# Altium schematic sheet RGB2HDMI.schdoc
size 316 x 216 mm
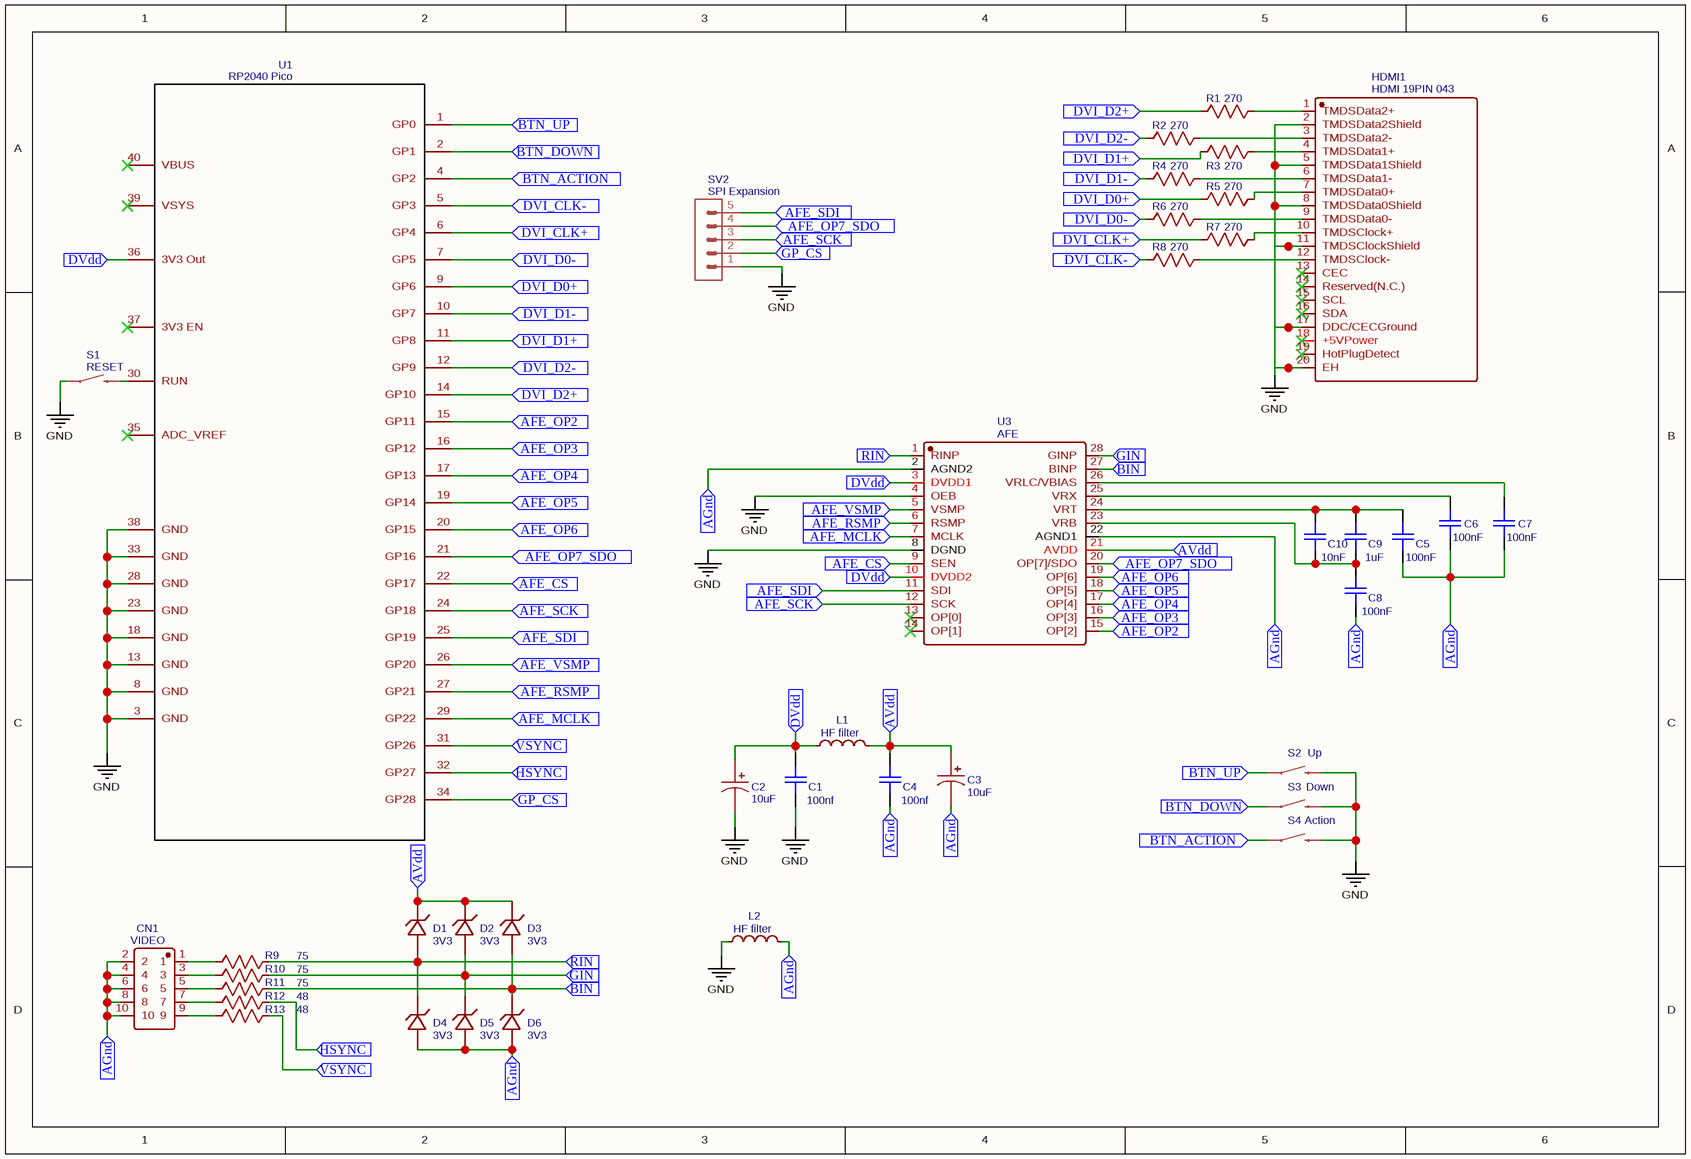
[diagram p0: RGB2HDMI.schdoc]

## Parts
C1  100nf  [C1206]
C2  10uF  [C1206]
C3  10uF  [C1206]
C4  100nf  [C1206]
C5  100nF  [C1206]
C6  100nF  [C1206]
C7  100nF  [C1206]
C8  100nF  [C1206]
C9  1uF  [C1206]
C10  10nF  [C1206]
CN1  VIDEO  [CONN-TH_CNJM2006WV-2X5P-9T]
D1  3V3  [SOD-123FL_L2.6-W1.6-LS3.5-RD]
D2  3V3  [SOD-123FL_L2.6-W1.6-LS3.5-RD]
D3  3V3  [SOD-123FL_L2.6-W1.6-LS3.5-RD]
D4  3V3  [SOD-123FL_L2.6-W1.6-LS3.5-RD]
D5  3V3  [SOD-123FL_L2.6-W1.6-LS3.5-RD]
D6  3V3  [SOD-123FL_L2.6-W1.6-LS3.5-RD]
HDMI1  HDMI 19PIN 043  [HDMI-SMD_HDMI-9PIN-043]
L1  HF filter  [L1206]
L2  HF filter  [L1206]
R1  270  [R0805]
R2  270  [R0805]
R3  270  [R0805]
R4  270  [R0805]
R5  270  [R0805]
R6  270  [R0805]
R7  270  [R0805]
R8  270  [R0805]
R9  75  [R0805]
R10  75  [R0805]
R11  75  [R0805]
R12  48  [R0805]
R13  48  [R0805]
S1  RESET  [SPARKFUN-SWITCHES_TACTILE_SWITCH_PTH_6.0MM]
S2  Up  [SPARKFUN-SWITCHES_TACTILE_SWITCH_PTH_6.0MM]
S3  Down  [SPARKFUN-SWITCHES_TACTILE_SWITCH_PTH_6.0MM]
S4  Action  [SPARKFUN-SWITCHES_TACTILE_SWITCH_PTH_6.0MM]
SV2  SPI Expansion  [CON-LSTB_MA05-1]
U1  RP2040 Pico  [RP2040 PICO]
U3  AFE  [SSOP-28_L10.2-W5.3-P0.65-LS7.8-BL]

## Ports
AFE_CS (in), AFE_MCLK (in), AFE_OP2 (in), AFE_OP3 (in), AFE_OP4 (in), AFE_OP5 (in), AFE_OP6 (in), AFE_OP7_SDO (in), AFE_RSMP (in), AFE_SCK (in), AFE_SDI (in), AFE_VSMP (in), AGnd (in), AVdd (in), BIN (in), BTN_ACTION (in), BTN_DOWN (in), BTN_UP (in), DVdd (in), DVI_CLK+ (in), DVI_CLK- (in), DVI_D0+ (in), DVI_D0- (in), DVI_D1+ (in), DVI_D1- (in), DVI_D2+ (in), DVI_D2- (in), GIN (in), GP_CS (in), HSYNC (in), RIN (in), VSYNC (in)

## Nets
GND: C1.1 C2.2 HDMI1.2(TMDSData2Shield) HDMI1.5(TMDSData1Shield) HDMI1.8(TMDSData0Shield) HDMI1.11(TMDSClockShield) HDMI1.17(DDC/CECGround) HDMI1.20(EH) L2.1 S1.1 S2.3 S3.3 S4.3 SV2.1 U1.3(GND) U1.8(GND) U1.13(GND) U1.18(GND) U1.23(GND) U1.28(GND) U1.33(GND) U1.38(GND) U3.4(OEB) U3.8(DGND)
AFE_CS: U1.22(GP17) U3.9(SEN) ; port AFE_CS
AFE_MCLK: U1.29(GP22) U3.7(MCLK) ; port AFE_MCLK
AFE_OP2: U1.15(GP11) U3.15(OP[2]) ; port AFE_OP2
AFE_OP3: U1.16(GP12) U3.16(OP[3]) ; port AFE_OP3
AFE_OP4: U1.17(GP13) U3.17(OP[4]) ; port AFE_OP4
AFE_OP5: U1.19(GP14) U3.18(OP[5]) ; port AFE_OP5
AFE_OP6: U1.20(GP15) U3.19(OP[6]) ; port AFE_OP6
AFE_OP7_SDO: SV2.4 U1.21(GP16) U3.20(OP[7]/SDO) ; port AFE_OP7_SDO
AFE_RSMP: U1.27(GP21) U3.6(RSMP) ; port AFE_RSMP
AFE_SCK: SV2.3 U1.24(GP18) U3.12(SCK) ; port AFE_SCK
AFE_SDI: SV2.5 U1.25(GP19) U3.11(SDI) ; port AFE_SDI
AFE_VSMP: U1.26(GP20) U3.5(VSMP) ; port AFE_VSMP
AGnd: C3.2 C4.1 C5.1 C6.2 C7.2 C8.1 CN1.2 CN1.4 CN1.6 CN1.8 CN1.10 D4.2(A) D5.2(A) D6.2(A) L2.2 U3.2(AGND2) U3.22(AGND1) ; port AGnd
AVdd: C3.1 C4.2 D1.1(K) D2.1(K) D3.1(K) L1.2 U3.21(AVDD) ; port AVdd
BIN: D3.2(A) D6.1(K) R11.2 U3.27(BINP) ; port BIN
BTN_ACTION: S4.1 U1.4(GP2) ; port BTN_ACTION
BTN_DOWN: S3.1 U1.2(GP1) ; port BTN_DOWN
BTN_UP: S2.1 U1.1(GP0) ; port BTN_UP
DVdd: C1.2 C2.1 L1.1 U1.36(3V3_Out) U3.3(DVDD1) U3.10(DVDD2) ; port DVdd
DVI_CLK+: R7.1 U1.6(GP4) ; port DVI_CLK+
DVI_CLK-: R8.1 U1.5(GP3) ; port DVI_CLK-
DVI_D0+: R5.1 U1.9(GP6) ; port DVI_D0+
DVI_D0-: R6.1 U1.7(GP5) ; port DVI_D0-
DVI_D1+: R3.1 U1.11(GP8) ; port DVI_D1+
DVI_D1-: R4.1 U1.10(GP7) ; port DVI_D1-
DVI_D2+: R1.1 U1.14(GP10) ; port DVI_D2+
DVI_D2-: R2.1 U1.12(GP9) ; port DVI_D2-
GIN: D2.2(A) D5.1(K) R10.2 U3.28(GINP) ; port GIN
GP_CS: SV2.2 U1.34(GP28) ; port GP_CS
HSYNC: R12.2 U1.32(GP27) ; port HSYNC
RIN: D1.2(A) D4.1(K) R9.2 U3.1(RINP) ; port RIN
VSYNC: R13.2 U1.31(GP26) ; port VSYNC
NetC5_2: C5.2 C9.2 C10.2 U3.24(VRT)
NetC6_1: C6.1 U3.25(VRX)
NetC7_1: C7.1 U3.26(VRLC/VBIAS)
NetC8_2: C8.2 C9.1 C10.1 U3.23(VRB)
NetCN1_1: CN1.1 R9.1
NetCN1_3: CN1.3 R10.1
NetCN1_5: CN1.5 R11.1
NetCN1_7: CN1.7 R12.1
NetCN1_9: CN1.9 R13.1
NetHDMI1_1: HDMI1.1(TMDSData2+) R1.2
NetHDMI1_3: HDMI1.3(TMDSData2-) R2.2
NetHDMI1_4: HDMI1.4(TMDSData1+) R3.2
NetHDMI1_6: HDMI1.6(TMDSData1-) R4.2
NetHDMI1_7: HDMI1.7(TMDSData0+) R5.2
NetHDMI1_9: HDMI1.9(TMDSData0-) R6.2
NetHDMI1_10: HDMI1.10(TMDSClock+) R7.2
NetHDMI1_12: HDMI1.12(TMDSClock-) R8.2
NetS1_3: S1.3 U1.30(RUN)

Not connected (* = marked no-connect by the designer): HDMI1 13(CEC)* 14(Reserved(N.C.))* 15(SCL)* 16(SDA)* 18(+5VPower)* 19(HotPlugDetect)*; U1 35(ADC_VREF)* 37(3V3_EN)* 39(VSYS)* 40(VBUS)*; U3 13(OP[0])* 14(OP[1])*

## Library data of the parts
C1 C4 = 100nf: BOM_Manufacturer: ReliaPro; BOM_Manufacturer Part: Ceramic capacitors47PF 3KV; nameAlias: Value; Contributor: LCSC; BOM_Supplier: LCSC; BOM_Supplier Part: C19375; spicePre: C; spiceSymbolName: CERAMIC CAPACITOR 100NF 50V LEADED
C2 C3 = 10uF: BOM_Manufacturer: KEMET(基美); BOM_Manufacturer Part: A700V106M12RATE040; Contributor: LCSC; nameAlias: Capacitance; BOM_Supplier: LCSC; BOM_Supplier Part: C2162687; BOM_JLCPCB Part Class: Extended Part; spicePre: R; spiceSymbolName: A700V106M12RATE040
C5-C8 = 100nF: BOM_Manufacturer: ReliaPro; BOM_Manufacturer Part: Ceramic capacitors47PF 3KV; nameAlias: Value; Contributor: LCSC; BOM_Supplier: LCSC; BOM_Supplier Part: C19375; spicePre: C; spiceSymbolName: CERAMIC CAPACITOR 100NF 50V LEADED
C9 = 1uF: BOM_Manufacturer: ReliaPro; BOM_Manufacturer Part: Ceramic capacitors47PF 3KV; nameAlias: Value; Contributor: LCSC; BOM_Supplier: LCSC; BOM_Supplier Part: C19375; spicePre: C; spiceSymbolName: CERAMIC CAPACITOR 100NF 50V LEADED
C10 = 10nF: BOM_Manufacturer: ReliaPro; BOM_Manufacturer Part: Ceramic capacitors47PF 3KV; nameAlias: Value; Contributor: LCSC; BOM_Supplier: LCSC; BOM_Supplier Part: C19375; spicePre: C; spiceSymbolName: CERAMIC CAPACITOR 100NF 50V LEADED
CN1 = VIDEO: BOM_Manufacturer: CNJM(九木精密); BOM_Manufacturer Part: CNJM2006WV-2X5P-9T; Contributor: LCSC; BOM_Supplier: LCSC; BOM_Supplier Part: C881523; spicePre: C; spiceSymbolName: CNJM2006WV-2X5P-9T
D1-D6 = 3V3: BOM_Manufacturer: Nexperia; BOM_Manufacturer Part: BZT52H-B43,115; Contributor: LCSC; BOM_Supplier: LCSC; BOM_Supplier Part: C179373; BOM_JLCPCB Part Class: Extended Part; spicePre: D; spiceSymbolName: BZT52H-B43,115
HDMI1 = HDMI 19PIN 043: BOM_Manufacturer: SHOU HAN(首韩); Contributor: LCSC; BOM_Supplier: LCSC; BOM_Supplier Part: C2858275; BOM_Manufacturer Part: HDMI 19PIN 043; spicePre: U; spiceSymbolName: HDMI 19PIN 043
L1 L2 = HF filter: BOM_Manufacturer: ABRACON; BOM_Manufacturer Part: ACML-0603H-601-T; Contributor: LCSC; BOM_Supplier: LCSC; BOM_Supplier Part: C2661928; BOM_JLCPCB Part Class: Extended Part; spicePre: L; spiceSymbolName: ACML-0603H-601-T
R1-R8 = 270: nameAlias: Value(Ω); Contributor: LCEDA_Lib; spicePre: R; spiceSymbolName: R_0603_US
R9-R11 = 75: nameAlias: Value(Ω); Contributor: LCEDA_Lib; spicePre: R; spiceSymbolName: R_0603_US
R12 R13 = 48: nameAlias: Value(Ω); Contributor: LCEDA_Lib; spicePre: R; spiceSymbolName: R_0603_US
S1 = RESET: Contributor: Owen Pratama; spicePre: S; spiceSymbolName: SPARKFUN-SWITCHES_MOMENTARY-SWITCH-SPST-PTH-6.0MM
S2 = Up: Contributor: Owen Pratama; spicePre: S; spiceSymbolName: SPARKFUN-SWITCHES_MOMENTARY-SWITCH-SPST-PTH-6.0MM
S3 = Down: Contributor: Owen Pratama; spicePre: S; spiceSymbolName: SPARKFUN-SWITCHES_MOMENTARY-SWITCH-SPST-PTH-6.0MM
S4 = Action: Contributor: Owen Pratama; spicePre: S; spiceSymbolName: SPARKFUN-SWITCHES_MOMENTARY-SWITCH-SPST-PTH-6.0MM
SV2 = SPI Expansion: Contributor: Mr Tesla; spicePre: S; spiceSymbolName: CON-LSTB_MA05-1
U1 = RP2040 Pico: Contributor: gordond1980; spicePre: U; spiceSymbolName: RP2040 Pico
U3 = AFE: BOM_Manufacturer: Cirrus Logic; BOM_Manufacturer Part: WM8213SCDS/V; Contributor: LCSC; BOM_Supplier: LCSC; BOM_Supplier Part: C431490; BOM_JLCPCB Part Class: Extended Part; spicePre: U; spiceSymbolName: WM8213SCDS/V